# Altium schematic sheet Power.SchDoc
size B
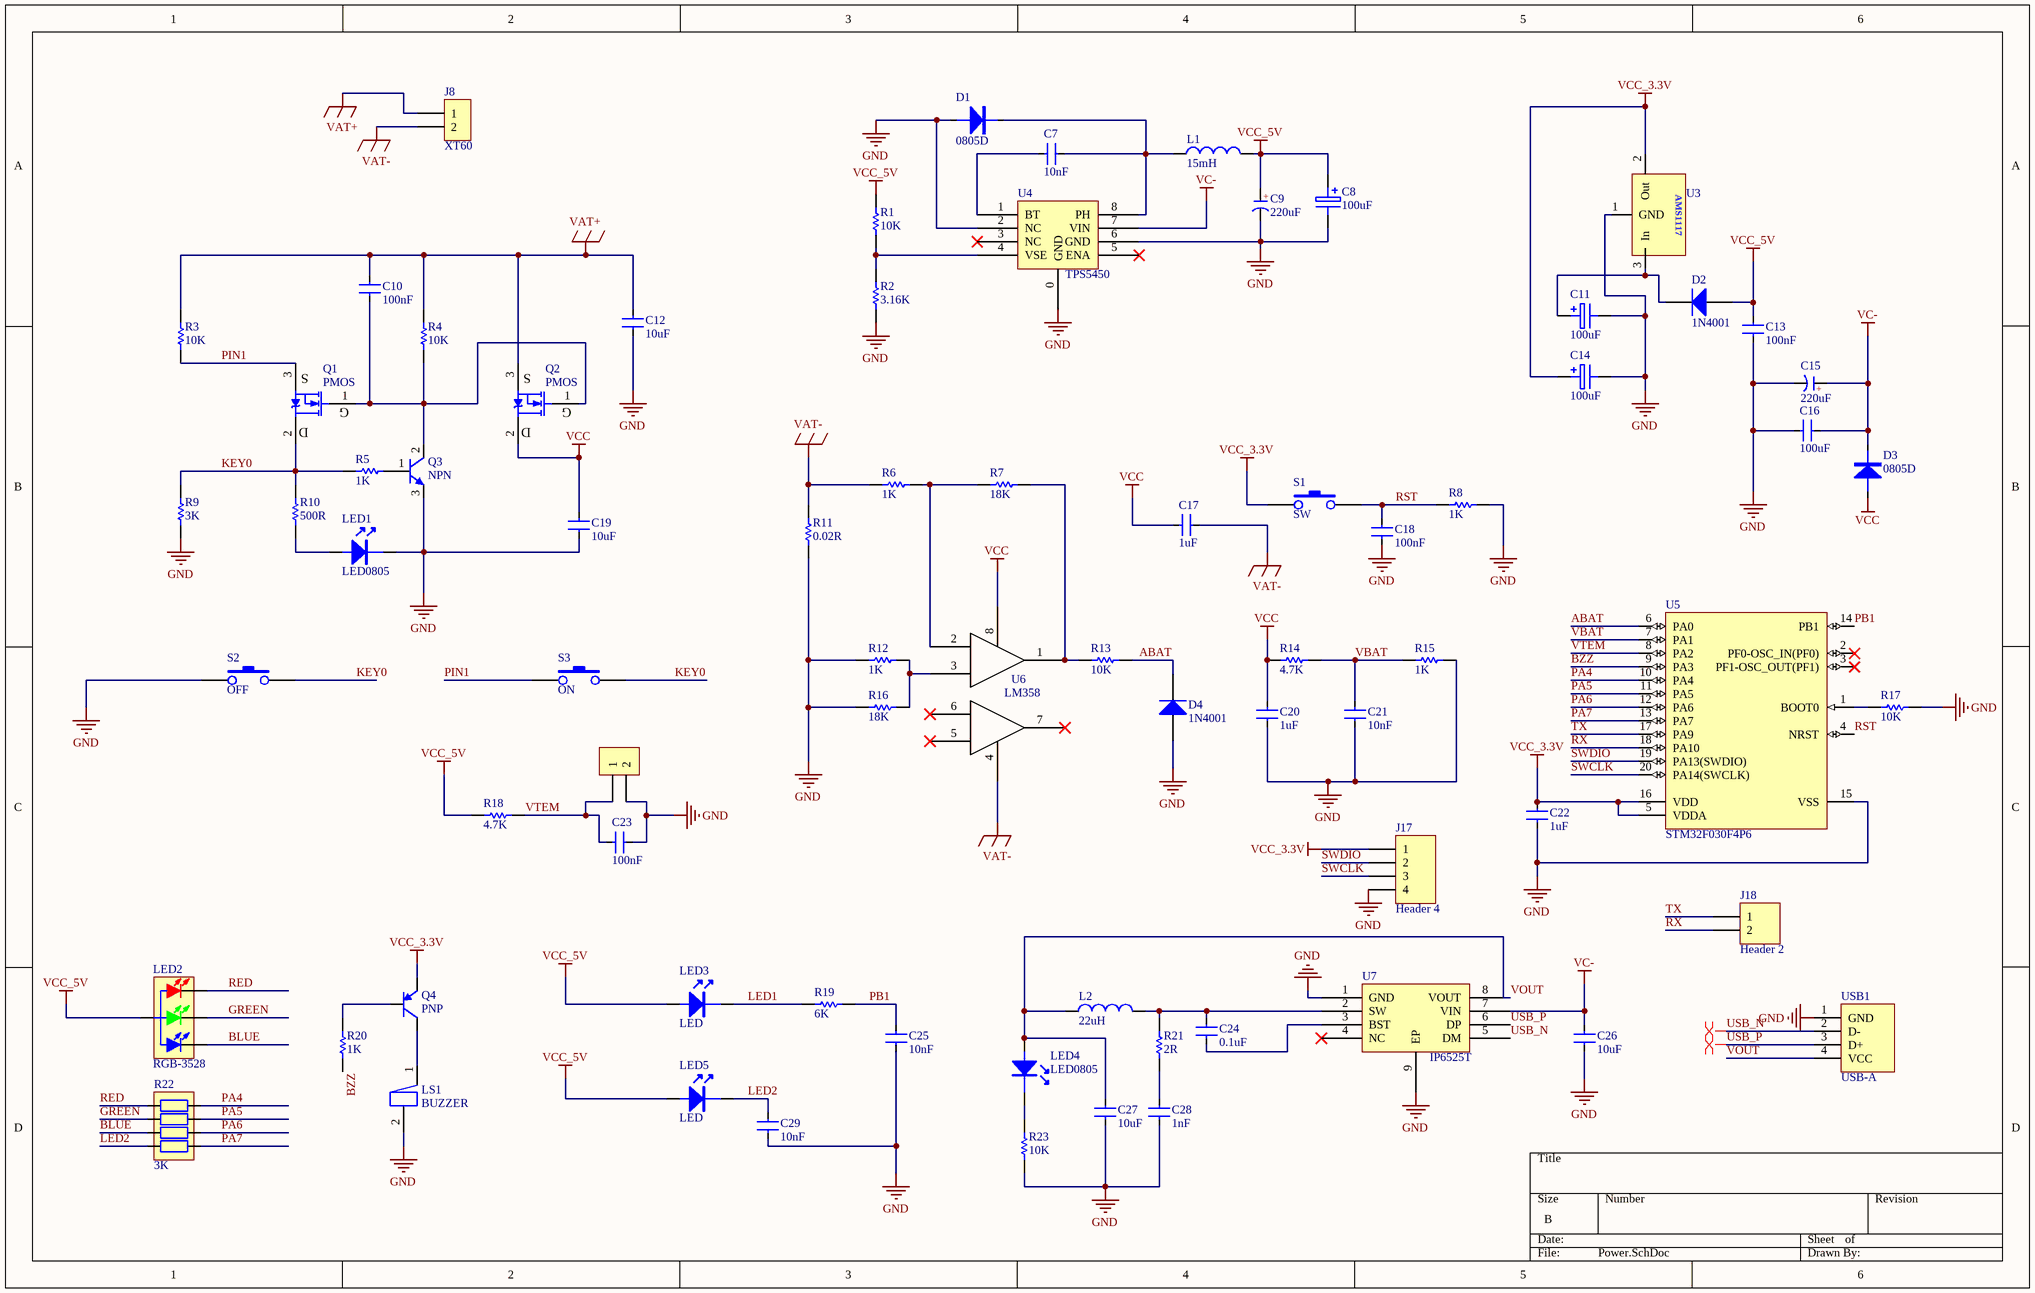
[diagram p0: Power.SchDoc]

## Parts
C7  10nF  [0603_C]
C8  100uF  [CASE-C_6032]
C9  220uF  [CASE-E_7343]
C10  100nF  [0603_C]
C11  100uF  [CASE-C_6032]
C12  10uF  [1206_C]
C13  100nF  [0603_C]
C14  100uF  [CASE-B_3528]
C15  220uF  [CASE-E_7343]
C16  100uF  [1206_C]
C17  1uF  [0603_C]
C18  100nF  [0603_C]
C19  10uF  [1206_C]
C20  1uF  [0603_C]
C21  10nF  [0603_C]
C22  1uF  [0603_C]
C23  100nF  [0603_C]
C24  0.1uF  [0603_C]
C25  10nF  [0603_C]
C26  10uF  [1206_C]
C27  10uF  [0603_C]
C28  1nF  [0603_C]
C29  10nF  [0603_C]
D1  0805D  [SMB N]
D2  Type: 1N4001  [DIODE-1206]  (hidden comment: Diode)
D3  0805D  [SMB N]
D4  Type: 1N4001  [DIODE-1206]  (hidden comment: Diode)
J8  XT60  [TX60-LI-S]
J17  Header 4  [XH2.54-WI-4P]
J18  Header 2  [XH2.54-LI-2P]
J？1  XT60  [LC-0805_R]  (value not drawn)
L1  15mH  [IND-SMD_L6.0-W6.0_FNR60XXS]
L2  22uH  [IND-SMD_L6.0-W6.0_FNR60XXS]
LED1  LED0805  [LC-0603_LED_S1]
LED2  RGB-3528  [RGB-3528]
LED3  LED  [LC-0603_LED_S1]
LED4  LED0805  [LC-0603_LED_S1]
LED5  LED  [LC-0603_LED_S1]
LS1  BUZZER  [Beep]
Q1  PMOS  [TO-252-2-180]
Q2  PMOS  [TO-252-2-180]
Q3  NPN  [SOT-23(SOT-23-3)]
Q4  PNP  [SOT-23(SOT-23-3)]
R1  10K  [0603_R]
R2  3.16K  [0603_R]
R3  10K  [0603_R]
R4  10K  [0603_R]
R5  1K  [0603_R]
R6  1K  [0603_R]
R7  18K  [0603_R]
R8  1K  [0603_R]
R9  3K  [0603_R]
R10  500R  [0603_R]
R11  0.02R  [2512_R]
R12  1K  [0603_R]
R13  10K  [0603_R]
R14  4.7K  [0603_R]
R15  1K  [0603_R]
R16  18K  [0603_R]
R17  10K  [0603_R]
R18  4.7K  [0603_R]
R19  6K  [0603_R]
R20  1K  [0603_R]
R21  2R  [0603_R]
R22  3K  [0603_Rx4]
R23  10K  [0603_R]
S1  SW  [微动开关-1]
S2  OFF  [微动开关-1]
S3  ON  [微动开关-1]
U3  AMS1117  [AMS1117]  (value not drawn)
U4  TPS5450  [SOP-8_EP_150mil]
U5  STM32F030F4P6  [STM-TSSOP20_L]
U6  LM358  [SOIC-8_208mil]
U7  IP6525T  [IP6525T]
USB1  USB-A  [USB-A]

## Nets
GND: C8.2 C9.2(K) C11.2 C12.1 C13.1 C14.2 C15.2(K) C16.1 C18.1 C19.1 C20.1 C21.2 C22.1 C23.1 C25.2 C26.1 C27.1 C28.1 C29.2 D1.A D4.1(A) J17.4 J？1.2 LED1.K LS1.2(-) Q3.3(E) R2.1 R8.2 R9.1 R11.1 R12.2 R15.1 R16.2 R17.2 R23.1 S2.1 U3.1(GND) U4.0(GND) U4.2(NC) U4.6(GND) U5.15(VSS) U7.1(GND) U7.9(EP) USB1.1(GND)
VAT+: C10.2 C12.2 J8.1 Q2.3(S) R3.2 R4.2
VAT-: C17.1 J8.2 R6.2 R11.2 U6.4
VC-: C15.1(A) C16.2 C26.2 D3.K U4.7(VIN) U7.7(VIN)
VCC: C17.2 C19.2 C20.2 D3.A Q2.2(D) R14.2 U6.8
VCC_3.3V: C14.1 C22.2 J17.1 Q4.3(E) S1.1 U3.2(Out) U5.5(VDDA) U5.16(VDD)
VCC_5V: C8.1 C9.1(A) C13.2 D2.1(A) L1.2 LED2.4(A) LED3.A LED5.A R1.2 R18.2
ABAT: D4.2(K) R13.1 U5.6(PA0)
BLUE: LED2.3(BULE_K) R22.3
BZZ: R20.2 U5.9(PA3)
GREEN: LED2.2(GREEN_K) R22.2
KEY0: Q1.2(D) R5.2 R9.2 R10.2 S2.2 S3.2
LED1: LED3.K R19.1
LED2: C29.1 LED5.K R22.4
PA4: R22.8 U5.10(PA4)
PA5: R22.7 U5.11(PA5)
PA6: R22.6 U5.12(PA6)
PA7: R22.5 U5.13(PA7)
PB1: C25.1 R19.2 U5.14(PB1)
PIN1: Q1.3(S) R3.1 S3.1
RED: LED2.1(RED_K) R22.1
RST: C18.2 R8.1 S1.2 U5.4(NRST)
RX: J18.2 U5.18(PA10)
SWCLK: J17.3 U5.20(PA14(SWCLK))
SWDIO: J17.2 U5.19(PA13(SWDIO))
TX: J18.1 U5.17(PA9)
USB_N: U7.5(DM) USB1.2(D-)
USB_P: U7.6(DP) USB1.3(D+)
VBAT: C21.1 R14.1 R15.2 U5.7(PA1)
VOUT: C27.2 L2.1 LED4.A U7.8(VOUT) USB1.4(VCC)
VTEM: C23.2 J？1.1 R18.1 U5.8(PA2)
NetC7_1: C7.1 U4.1(BT)
NetC7_2: C7.2 D1.K L1.1 U4.8(PH)
NetC10_1: C10.1 Q1.1(G) Q2.1(G) Q3.2(C) R4.1
NetC11_1: C11.1 D2.2(K) U3.3(In)
NetC24_1: C24.1 U7.3(BST)
NetC24_2: C24.2 L2.2 R21.2 U7.2(SW)
NetC28_2: C28.2 R21.1
NetLED1_A: LED1.A R10.1
NetLED4_K: LED4.K R23.2
NetLS1_1: LS1.1(+) Q4.2(C)
NetQ3_1: Q3.1(B) R5.1
NetQ4_1: Q4.1(B) R20.1
NetR1_1: R1.1 R2.2 U4.4(VSE)
NetR6_1: R6.1 R7.2 U6.2
NetR7_1: R7.1 R13.2 U6.1
NetR12_1: R12.1 R16.1 U6.3
NetR17_1: R17.1 U5.1(BOOT0)

Not connected (* = marked no-connect by the designer): U4 3(NC)* 5(ENA)*; U5 2(PF0-OSC_IN(PF0))* 3(PF1-OSC_OUT(PF1))*; U6 5* 6* 7*; U7 4(NC)*

## Layout directives
differential pair: USB_N, USB_P

## Notes on the sheet
- (in symbol C-CS) +

## Library data of the parts
C7 C10 C12 C13 C16-C29 = C0805
C8 C11 C14 = CAP-E: 电解电容
C9 C15 = C-CS: 直插固态电容; 版权归属: 源创客; BOM名称: 直插固态电容; 学习资源: www.ooocke.com
D2 D4 = Diode: 二极管; Published: 8-Jun-2000; LatestRevisionDate: 17-Jul-2002; LatestRevisionNote: Re-released for DXP Platform.; PackageDocument: Sep-1996; PackageReference: SMC; Publisher: Altium Limited; Code_JEDEC: DO-214-AB
J8 J？1 = FD-SIP2
J17 = Header 4: Header, 4-Pin; LatestRevisionDate: 17-Jul-2002; LatestRevisionNote: Re-released for DXP Platform.; Publisher: Altium Limited
J18 = Header 2: Header, 2-Pin; LatestRevisionDate: 17-Jul-2002; LatestRevisionNote: Re-released for DXP Platform.; Publisher: Altium Limited
L1 L2 = 贴片电感
LED2 = LED-RGB-3528: 三基色LED; 版权归属: 源创客; BOM名称: 三基色LED; 学习资源: www.ooocke.com
LED3 LED5 = LED0805
Q1 Q2 = P40NF10L: N沟场效应管; 版权归属: 源创客; BOM名称: N沟场效应管; 学习资源: www.ooocke.com
Q3 = 44H11: 互补功率-NPN型; 版权归属: 源创客; 属性: 80V 8A 50W; BOM名称: 互补功率-NPN型; 学习资源: www.ooocke.com
Q4 = TIP42C: 互补功率-PNP型; 版权归属: 源创客; 属性: 100V 6A 65W; BOM名称: 互补功率-PNP型; 学习资源: www.ooocke.com
R1-R21 R23 = Res1: Resistor
  R1-R16 R18-R21 R23: Published: 8-Jun-2000; LatestRevisionDate: 17-Jul-2002; LatestRevisionNote: Re-released for DXP Platform.; PackageReference: AXIAL-0.3; Publisher: Altium Limited; PackageDescription: Axial Device, Thru-Hole; 2 Leads; 0.3 in Pin Spacing
R22 = R-8P4R: 贴片网络排阻; 版权归属: 源创客; BOM名称: 贴片网络排阻; 学习资源: www.ooocke.com
S1-S3 = 微动开关
U4 = Component_6
U5 = STM32F030F4P6: ARM Cortex-M0 32-bit MCU, 16 KB Flash, 4 KB Internal RAM, 15 I/Os, 20-pin TSSOP, -40 to 85 degC, Tube; FLASH Size (Prog) (kB): 16; I/Os (High Current): 15; Internal RAM Size (kB): 4; Operating Frequency(F) (Processor speed) (MHz): 48; Supply Voltage(Vcc) min (V): 2.4; DatasheetVersion: Rev. 1; PackageVersion: Rev. 1, 11/2012; PackageReference: TSSOP20; PackageDescription: 20-Pin Thin Shrink Small Outline Package, 6.5 x 4.4 mm Body, 0.65 mm Pitch; Supplier 1: Digi-Key; Supplier Part Number 1: 497-14044-5-ND; Supplier 2: Newark; Supplier Part Number 2: 06X3648; Supplier 3: Mouser; Supplier Part Number 3: 511-STM32F030F4P6; Core: ARM Cortex-M0; Packing: Tube; Mounting Technology: Surface Mount; PartNumber: STM32F030F4P6; ComponentLink1Description: Manufacturer URL; ComponentLink1URL: http://www.st.com/web/en/home.html; ComponentLink2Description: Datasheet; ComponentLink2URL: http://www.st.com/st-web-ui/static/active/en/resource/technical/document/datasheet/DM00088500.pdf; ComponentLink3Description: Package Specification; ComponentLink3URL: http://www.st.com/st-web-ui/static/active/en/resource/technical/document/datasheet/DM00065136.pdf
U6 = Component_8
U7 = Component_7